# EAGLE schematic 5ButtonSwitch.ItsyBitsyM0.Rev1.1 (EAGLE 8.6.0)
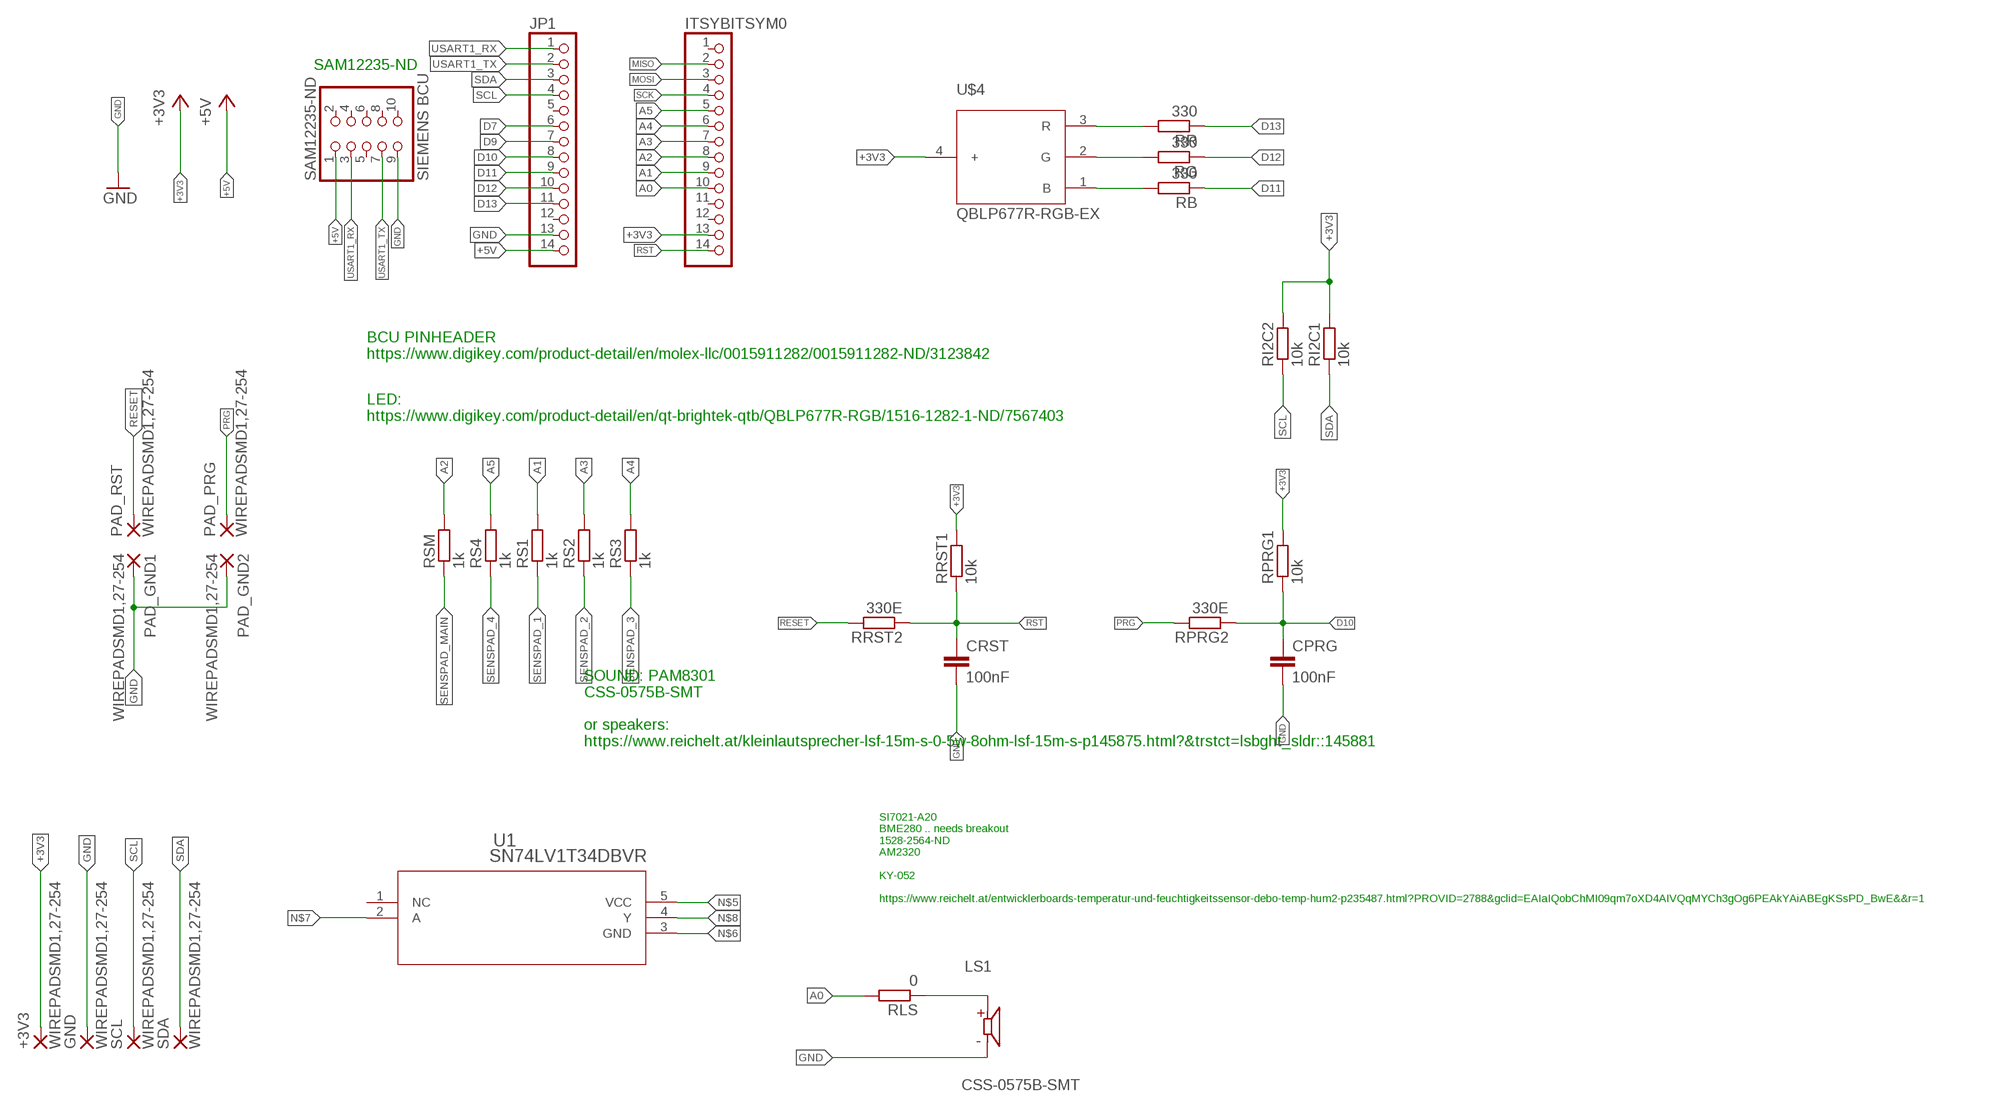
[diagram p0: schematic, sheet 1]

## Parts
+3V3  WIREPADSMD1,27-254  [SMD1,27-2,54]
CPRG  100nF  C-EUC1206  [C1206]
CRST  100nF  C-EUC1206  [C1206]
GND  WIREPADSMD1,27-254  [SMD1,27-2,54]
ITSYBITSYM0  PINHD-1X141X14_SMT  [1X14_SMT]
JP1  PINHD-1X141X14_SMT  [1X14_SMT]
LS1  CSS-0575B-SMT  [CUI_CSS-0575B-SMT]
PAD_GND1  WIREPADSMD1,27-254  [SMD1,27-2,54]
PAD_GND2  WIREPADSMD1,27-254  [SMD1,27-2,54]
PAD_PRG  WIREPADSMD1,27-254  [SMD1,27-2,54]
PAD_RST  WIREPADSMD1,27-254  [SMD1,27-2,54]
RB  330  R-EU_R1206  [R1206]
RG  330  R-EU_R1206  [R1206]
RI2C1  10k  R-EU_R1206  [R1206]
RI2C2  10k  R-EU_R1206  [R1206]
RLS  0  R-EU_R1206  [R1206]
RPRG1  10k  R-EU_R1206  [R1206]
RPRG2  330E  R-EU_R1206  [R1206]
RR  330  R-EU_R1206  [R1206]
RRST1  10k  R-EU_R1206  [R1206]
RRST2  330E  R-EU_R1206  [R1206]
RS1  1k  R-EU_R1206  [R1206]
RS2  1k  R-EU_R1206  [R1206]
RS3  1k  R-EU_R1206  [R1206]
RS4  1k  R-EU_R1206  [R1206]
RSM  1k  R-EU_R1206  [R1206]
SAM12235-ND  SIEMENS BCU  PINHD-2X5_2.54-SMD  [2X05SMD]
SCL  WIREPADSMD1,27-254  [SMD1,27-2,54]
SDA  WIREPADSMD1,27-254  [SMD1,27-2,54]
U1  SN74LV1T34DBVR  [DBV5]
U$4  QBLP677R-RGB-EX  [PLCC4R_EX]

## Nets
+3V3: +3V3.1(P) ITSYBITSYM0.13 RI2C1.2 RI2C2.2 RPRG1.2 RRST1.2 U$4.4(+)
+5V: JP1.14 SAM12235-ND.1
A0: ITSYBITSYM0.10 RLS.2
A1: ITSYBITSYM0.9 RS1.2
A2: ITSYBITSYM0.8 RSM.2
A3: ITSYBITSYM0.7 RS2.2
A4: ITSYBITSYM0.6 RS3.2
A5: ITSYBITSYM0.5 RS4.2
D7: JP1.6
D9: JP1.7
D10: CPRG.1 JP1.8 RPRG1.1 RPRG2.1
D11: JP1.9 RB.1
D12: JP1.10 RG.1
D13: JP1.11 RR.1
GND: CPRG.2 CRST.2 GND.1(P) JP1.13 LS1.2(N) PAD_GND1.1(P) PAD_GND2.1(P) SAM12235-ND.9
MISO: ITSYBITSYM0.2
MOSI: ITSYBITSYM0.3
N$1: RB.2 U$4.1(B)
N$2: RG.2 U$4.2(G)
N$3: RR.2 U$4.3(R)
N$4: LS1.1(P) RLS.1
N$5: U1.5(VCC)
N$6: U1.3(GND)
N$7: U1.2(A)
N$8: U1.4(Y)
PRG: PAD_PRG.1(P) RPRG2.2
RESET: PAD_RST.1(P) RRST2.2
RST: CRST.1 ITSYBITSYM0.14 RRST1.1 RRST2.1
SCK: ITSYBITSYM0.4
SCL: JP1.4 RI2C2.1 SCL.1(P)
SDA: JP1.3 RI2C1.1 SDA.1(P)
SENSPAD_1: RS1.1
SENSPAD_2: RS2.1
SENSPAD_3: RS3.1
SENSPAD_4: RS4.1
SENSPAD_MAIN: RSM.1
USART1_RX: JP1.1 SAM12235-ND.3
USART1_TX: JP1.2 SAM12235-ND.7
Unconnected: ITSYBITSYM0.1 ITSYBITSYM0.11 ITSYBITSYM0.12 JP1.5 JP1.12 SAM12235-ND.2 SAM12235-ND.4 SAM12235-ND.5 SAM12235-ND.6 SAM12235-ND.8 SAM12235-ND.10 U1.1(NC)

## Notes on the sheet
- SAM12235-ND
- BCU PINHEADER
  https://www.digikey.com/product-detail/en/molex-llc/0015911282/0015911282-ND/3123842
- LED:
  https://www.digikey.com/product-detail/en/qt-brightek-qtb/QBLP677R-RGB/1516-1282-1-ND/7567403
- SOUND: PAM8301
  CSS-0575B-SMT
  
  or speakers:
  https://www.reichelt.at/kleinlautsprecher-lsf-15m-s-0-5w-8ohm-lsf-15m-s-p145875.html?&trstct=lsbght_sldr::145881
- SI7021-A20
  BME280 .. needs breakout
  1528-2564-ND
  AM2320
  
  KY-052
  
  https://www.reichelt.at/entwicklerboards-temperatur-und-feuchtigkeitssensor-debo-temp-hum2-p235487.html?PROVID=2788&gclid=EAIaIQobChMI09qm7oXD4AIVQqMYCh3gOg6PEAkYAiABEgKSsPD_BwE&&r=1

## Library data of the parts
+3V3 GND PAD_GND1 PAD_GND2 PAD_PRG PAD_RST SCL SDA = wirepad:WIREPAD: Wire PAD connect wire on PCB
CPRG CRST = rcl:C-EU: CAPACITOR, European symbol; SPICEPREFIX: C
ITSYBITSYM0 JP1 = pinhead+:PINHD-1X14: PIN HEADER
LS1 = CSS-0575B-SMT:CSS-0575B-SMT: 5 mm, 3 V, 75 dB, Surface Mount (SMT), Magnetic Audio Transducer Buzzer; CUI_PURCHASE_URL: https://www.cui.com/product/audio/buzzers/audio-transducers/css-0575b-smt?utm_source=snapeda.com&utm_medium=referral&utm_campaign=snapedaBOM; DESCRIPTION: AUDIO MAGNETIC XDCR 2-4V SMD; DIGI-KEY_PART_NUMBER: 102-2202-1-ND; DIGI-KEY_PURCHASE_URL: https://www.digikey.com/product-detail/en/cui-inc/CSS-0575B-SMT-TR/102-2202-1-ND/2364651?utm_source=snapeda&utm_medium=aggregator&utm_campaign=symbol; MF: CUI Inc.; MP: CSS-0575B-SMT-TR; PACKAGE: CUI Inc.
RB RG RI2C1 RI2C2 RLS RPRG1 RPRG2 RR RRST1 RRST2 RS1-RS4 RSM = resistor:R-EU_: RESISTOR, European symbol
SAM12235-ND = pinhead:PINHD-2X5: PIN HEADER
U1 = SN74LV1T34DBVR:SN74LV1T34DBVR; MANUFACTURER_PART_NUMBER: SN74LV1T34DBVR; VENDOR: Texas Instruments
U$4 = ChriD_TouchSwitch:QBLP677R-RGB-EX